# Altium schematic sheet device-motor.SchDoc
size 297 x 209 mm
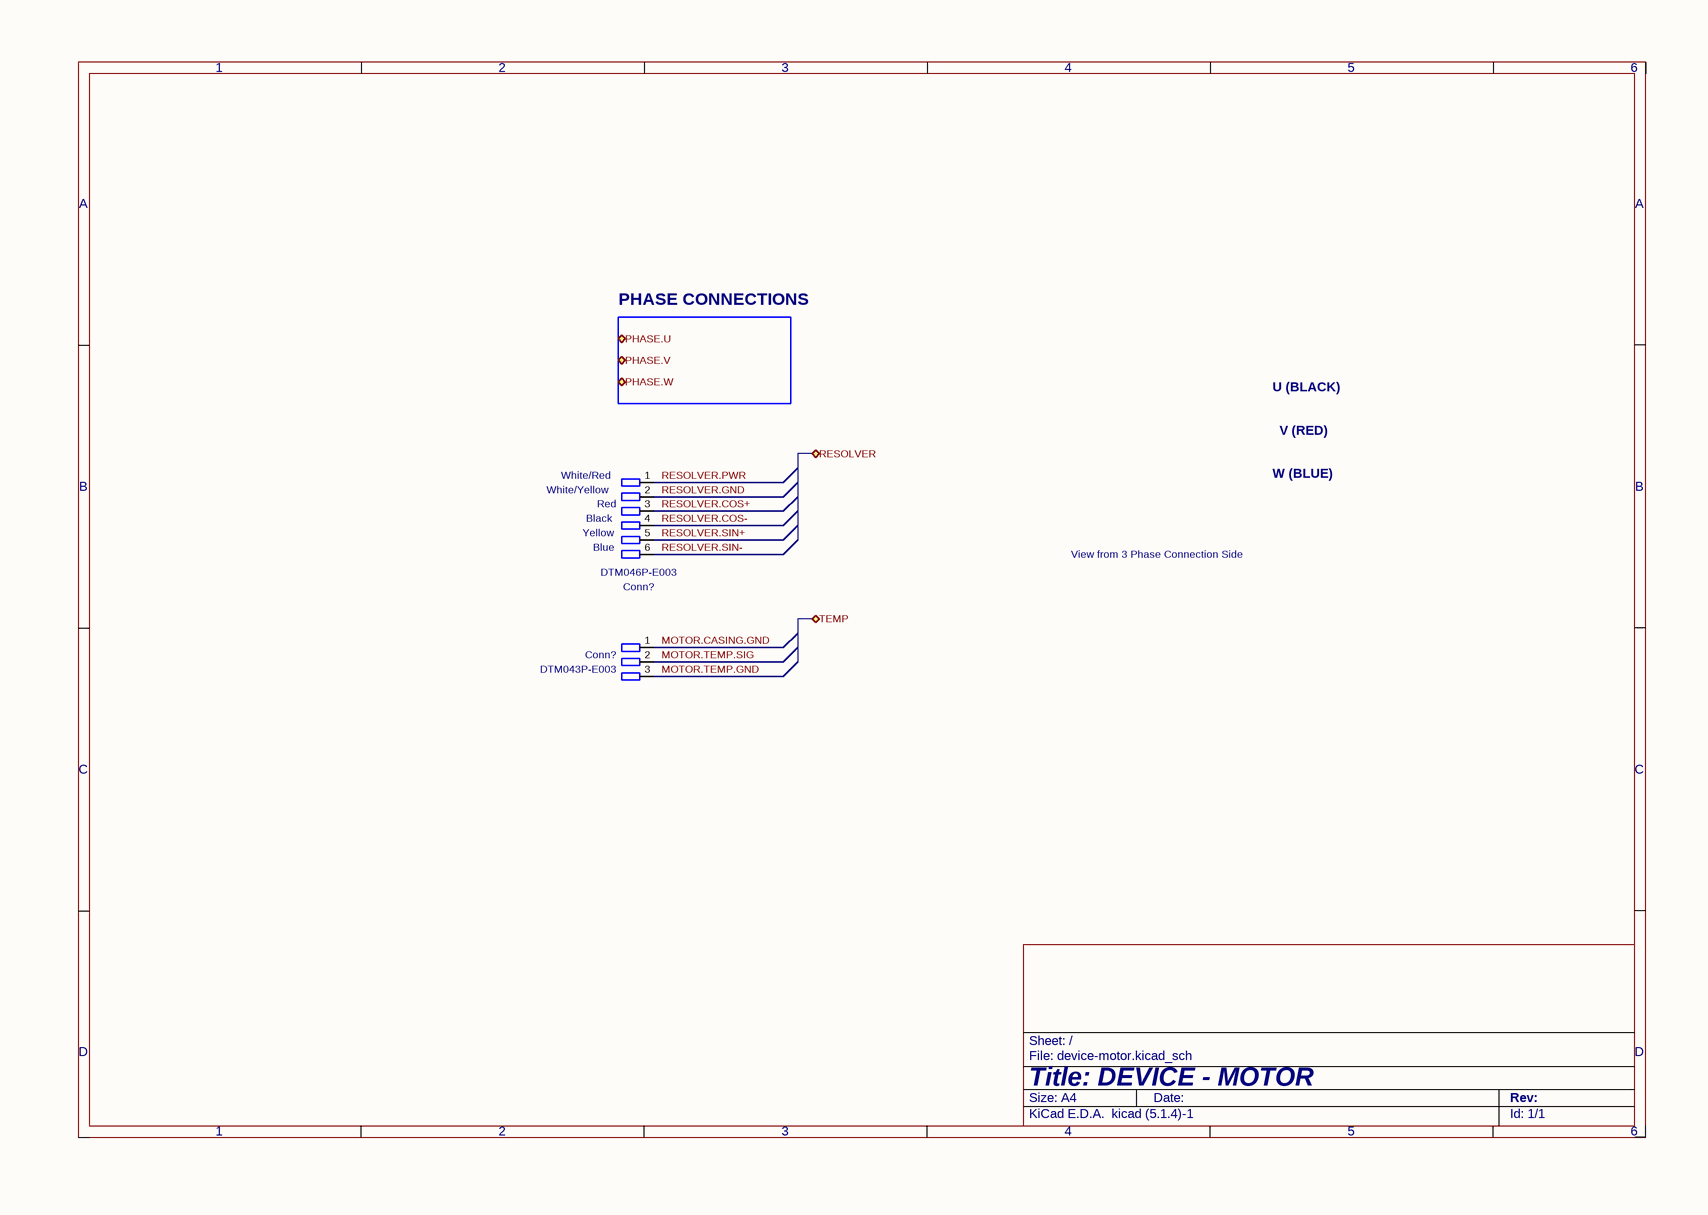
[diagram p0: device-motor.SchDoc]

## Parts
(Parts that share a designator on the sheet are numbered #1, #2 ... from top to bottom, then left to right.)
Conn?#1  P/N: DTM046P-E003  (hidden comment: Deutsch_DTM_6P_Pin)
Conn?#2  P/N: DTM043P-E003  (hidden comment: Deutsch_DTM_2P_Pin)

## Ports
PHASE.U (bidir), PHASE.V (bidir), PHASE.W (bidir), RESOLVER (bidir), TEMP (bidir)

## Nets
MOTOR.CASING.GND: Conn?#2.1
MOTOR.TEMP.GND: Conn?#2.3
MOTOR.TEMP.SIG: Conn?#2.2
RESOLVER.COS+: Conn?#1.3
RESOLVER.COS-: Conn?#1.4
RESOLVER.GND: Conn?#1.2
RESOLVER.PWR: Conn?#1.1
RESOLVER.SIN+: Conn?#1.5
RESOLVER.SIN-: Conn?#1.6

## Notes on the sheet
- PHASE CONNECTIONS
- U (BLACK)
- (near Conn?#1) White/Yellow
- (near Conn?#1) White/Red
- (near Conn?#1) Red
- W (BLUE)
- V (RED)
- (near Conn?#1) Yellow
- (near Conn?#1) Black
- (near Conn?#1) Blue
- View from 3 Phase Connection Side
- 1
- 2
- 3
- 4
- 5
- 6
- A
- B
- C
- D
- Title: DEVICE - MOTOR
- File: device-motor.kicad_sch
- Sheet: /
- KiCad E.D.A.  kicad (5.1.4)-1
- Size: A4
- Date:
- Rev:
- Id: 1/1

## Library data of the parts
Conn?#2 = Deutsch_DTM_3P_Pin: Value: Deutsch_DTM_2P_Pin
Conn?#1 = Deutsch_DTM_6P_Pin: Value: Deutsch_DTM_6P_Pin